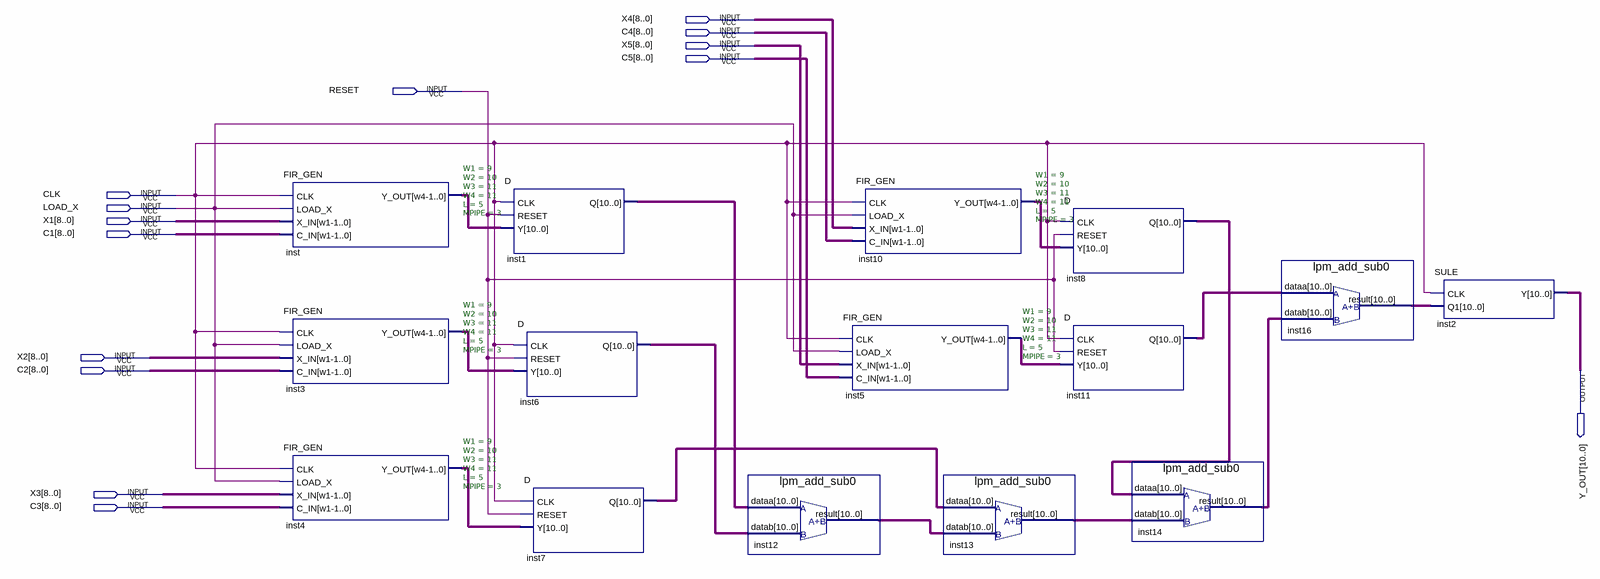
[diagram p0: schematic sheet]
// Quartus schematic CNN1.bdf as structural Verilog: 15 symbols, 14 pins
module CNN1 (
  input  [8:0] X4,
  input  [8:0] C4,
  input  [8:0] X5,
  input  [8:0] C5,
  input  RESET,
  input  CLK,
  input  LOAD_X,
  input  [8:0] X1,
  input  [8:0] C1,
  input  [8:0] X2,
  input  [8:0] C2,
  input  [8:0] X3,
  input  [8:0] C3,
  output [10:0] Y_OUT
);

  wire [10:0] inst1_q, inst3_y_out, inst4_y_out, inst5_y_out, inst6_q, inst7_q, inst8_q, inst10_y_out,
       inst11_q, inst12_result, inst13_result, inst14_result, inst16_result, inst_y_out;

  FIR_GEN #(.W1(9), .W2(10), .W3(11), .W4(11), .L(5), .MPIPE(3)) inst (
    .CLK(CLK), .LOAD_X(LOAD_X), .X_IN(X1), .C_IN(C1), .Y_OUT(inst_y_out));
  FIR_GEN #(.W1(9), .W2(10), .W3(11), .W4(11), .L(5), .MPIPE(3)) inst3 (
    .CLK(CLK), .LOAD_X(LOAD_X), .X_IN(X2), .C_IN(C2), .Y_OUT(inst3_y_out));
  FIR_GEN #(.W1(9), .W2(10), .W3(11), .W4(11), .L(5), .MPIPE(3)) inst4 (
    .CLK(CLK), .LOAD_X(LOAD_X), .X_IN(X3), .C_IN(C3), .Y_OUT(inst4_y_out));
  D inst1 (.CLK(CLK), .RESET(RESET), .Y(inst_y_out), .Q(inst1_q));
  D inst6 (.CLK(CLK), .RESET(RESET), .Y(inst3_y_out), .Q(inst6_q));
  D inst7 (.CLK(CLK), .RESET(RESET), .Y(inst4_y_out), .Q(inst7_q));
  lpm_add_sub0 inst12 (.dataa(inst1_q), .datab(inst6_q), .result(inst12_result));
  FIR_GEN #(.W1(9), .W2(10), .W3(11), .W4(11), .L(5), .MPIPE(3)) inst10 (
    .CLK(CLK), .LOAD_X(LOAD_X), .X_IN(X4), .C_IN(C4), .Y_OUT(inst10_y_out));
  FIR_GEN #(.W1(9), .W2(10), .W3(11), .W4(11), .L(5), .MPIPE(3)) inst5 (
    .CLK(CLK), .LOAD_X(LOAD_X), .X_IN(X5), .C_IN(C5), .Y_OUT(inst5_y_out));
  lpm_add_sub0 inst13 (.dataa(inst7_q), .datab(inst12_result), .result(inst13_result));
  D inst8 (.CLK(CLK), .RESET(RESET), .Y(inst10_y_out), .Q(inst8_q));
  D inst11 (.CLK(CLK), .RESET(RESET), .Y(inst5_y_out), .Q(inst11_q));
  lpm_add_sub0 inst14 (.dataa(inst8_q), .datab(inst13_result), .result(inst14_result));
  lpm_add_sub0 inst16 (.dataa(inst11_q), .datab(inst14_result), .result(inst16_result));
  SULE inst2 (.CLK(CLK), .Q1(inst16_result), .Y(Y_OUT));
endmodule
